# Altium project ControleArduino.PrjPcb
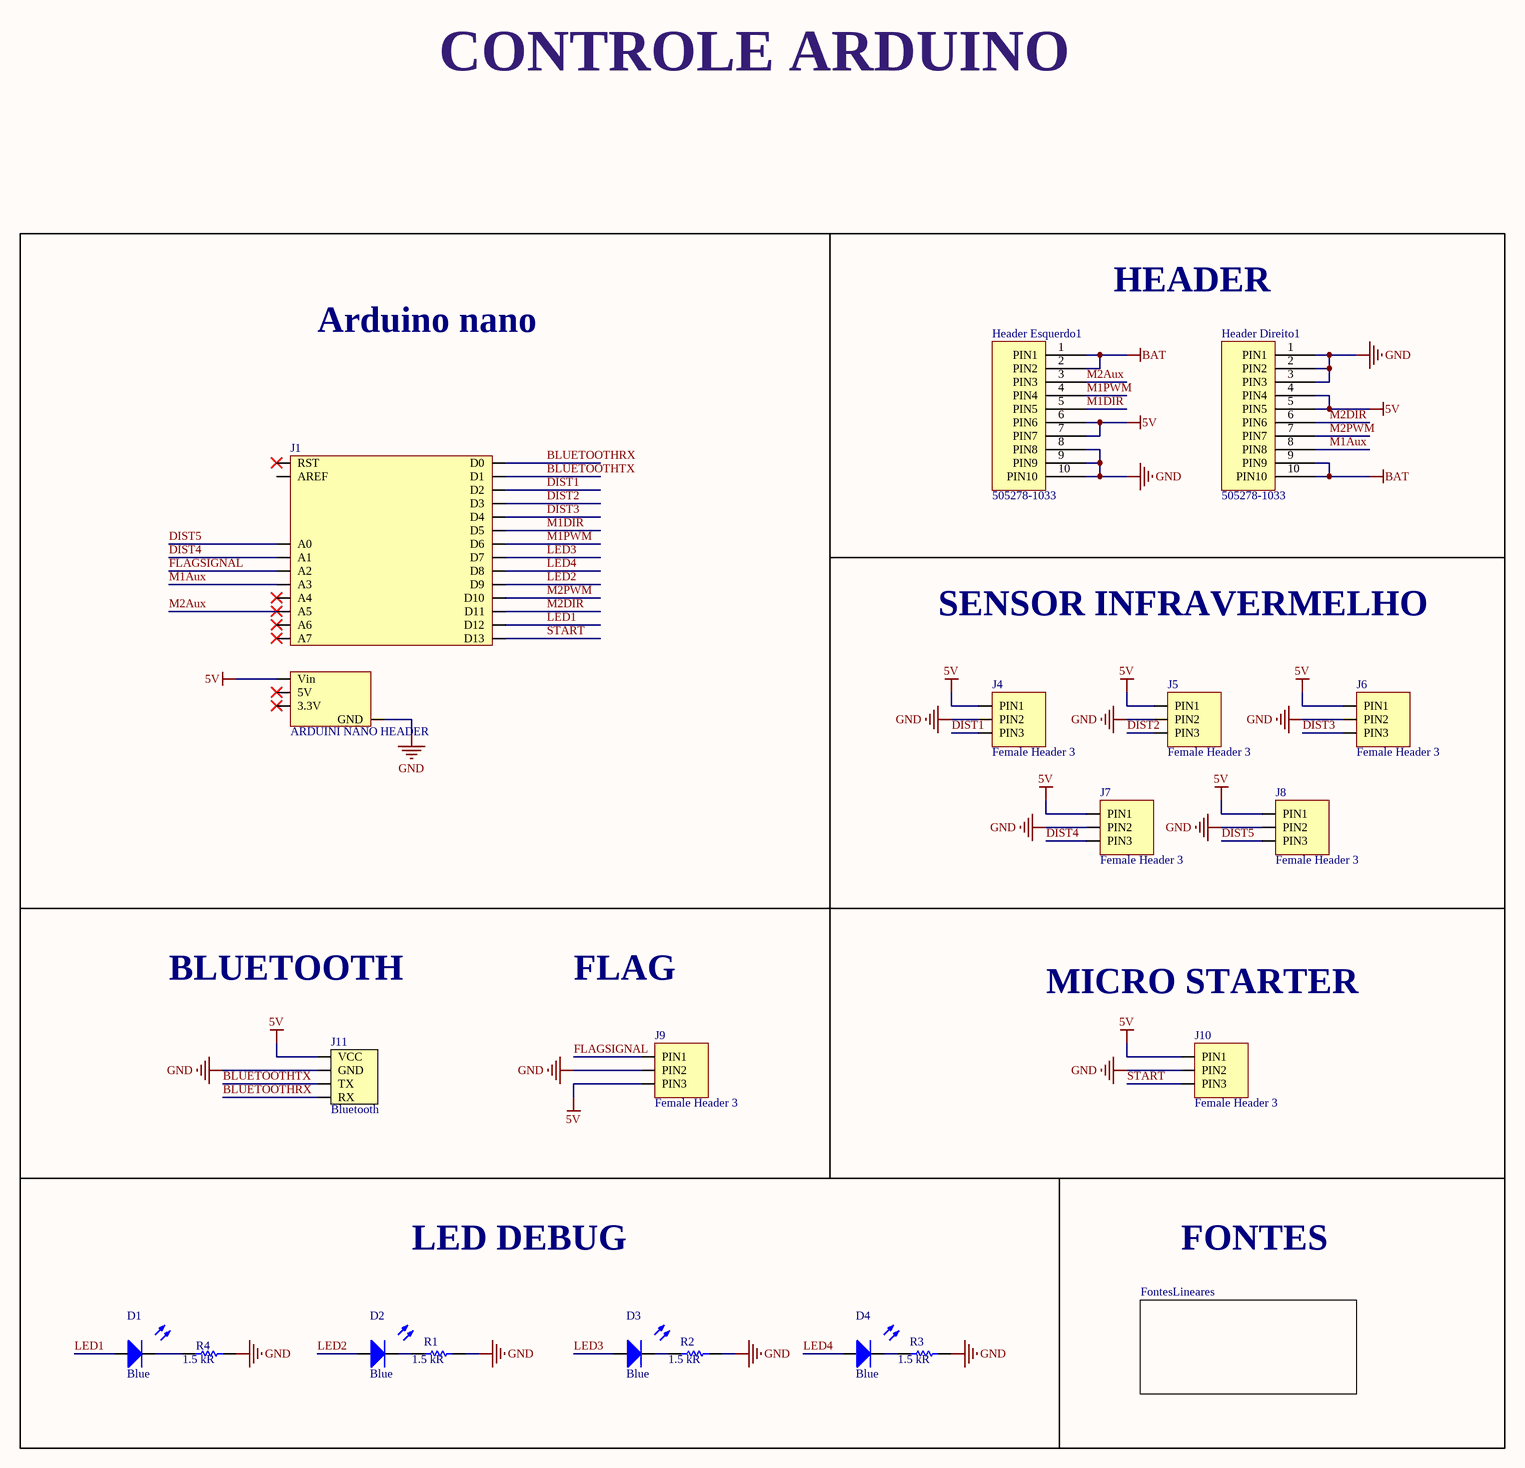
[diagram p0: controleArduino.SchDoc]
2 sheets, 28 parts. Net scope: global (net labels, ports and power ports of the same name join across sheets).
Board file: ControleArduinoPCB.PcbDoc
Sheets:
  controleArduino.SchDoc
    FontesLineares = FontesLineares.SchDoc

## Sheet controleArduino.SchDoc
size A2; SheetNumber: 1; SheetTotal: 2

### Parts
D1  Blue  [DIODO_2-SMD-3215]
D2  Blue  [DIODO_2-SMD-3215]
D3  Blue  [DIODO_2-SMD-3215]
D4  Blue  [DIODO_2-SMD-3215]
Header_Direito1  505278-1033  [FPC_CON]
Header_Esquerdo1  505278-1033  [FPC_CON]
J1  ARDUINI NANO HEADER  [ARDUINO NANO]
J4  Female Header 3  [FEMALE HEADER 3]
J5  Female Header 3  [FEMALE HEADER 3]
J6  Female Header 3  [FEMALE HEADER 3]
J7  Female Header 3  [FEMALE HEADER 3]
J8  Female Header 3  [FEMALE HEADER 3]
J9  Female Header 3  [FEMALE HEADER 3]
J10  Female Header 3  [FEMALE HEADER 3]
J11  Bluetooth  [BLUETOOTH]
R1  1.5 kR  [RESISTOR_0805]
R2  1.5 kR  [RESISTOR_0805]
R3  1.5 kR  [RESISTOR_0805]
R4  1.5 kR  [RESISTOR_0805]

### Sub-sheets
FontesLineares = FontesLineares: no entries

### Nets
5V: Header_Direito1.4(PIN4) Header_Direito1.5(PIN5) Header_Esquerdo1.6(PIN6) Header_Esquerdo1.7(PIN7) J1.Vin J4.PIN1 J5.PIN1 J6.PIN1 J7.PIN1 J8.PIN1 J9.PIN3 J10.PIN1 J11.VCC
BAT: Header_Direito1.9(PIN9) Header_Direito1.10(PIN10) Header_Esquerdo1.1(PIN1) Header_Esquerdo1.2(PIN2)
GND: Header_Direito1.1(PIN1) Header_Direito1.2(PIN2) Header_Direito1.3(PIN3) Header_Esquerdo1.8(PIN8) Header_Esquerdo1.9(PIN9) Header_Esquerdo1.10(PIN10) J1.GND J4.PIN2 J5.PIN2 J6.PIN2 J7.PIN2 J8.PIN2 J9.PIN2 J10.PIN2 J11.GND R1.2 R2.2 R3.2 R4.2
BLUETOOTHRX: J1.D0 J11.RX
BLUETOOTHTX: J1.D1 J11.TX
DIST1: J1.D2 J4.PIN3
DIST2: J1.D3 J5.PIN3
DIST3: J1.D4 J6.PIN3
DIST4: J1.A1 J7.PIN3
DIST5: J1.A0 J8.PIN3
FLAGSIGNAL: J1.A2 J9.PIN1
LED1: D1.A J1.D12
LED2: D2.A J1.D9
LED3: D3.A J1.D7
LED4: D4.A J1.D8
M1Aux: Header_Direito1.8(PIN8) J1.A3
M1DIR: Header_Esquerdo1.5(PIN5) J1.D5
M1PWM: Header_Esquerdo1.4(PIN4) J1.D6
M2Aux: Header_Esquerdo1.3(PIN3) J1.A5
M2DIR: Header_Direito1.6(PIN6) J1.D11
M2PWM: Header_Direito1.7(PIN7) J1.D10
START: J1.D13 J10.PIN3
NetD1_C: D1.C R4.1
NetD2_C: D2.C R1.1
NetD3_C: D3.C R2.1
NetD4_C: D4.C R3.1

Not connected (* = marked no-connect by the designer): J1 3.3V* 5V* A4* A6* A7* AREF RST*

### Notes on the sheet
- CONTROLE ARDUINO
- HEADER
- Arduino nano
- SENSOR INFRAVERMELHO
- BLUETOOTH
- FLAG
- MICRO STARTER
- LED DEBUG
- FONTES

### Library data of the parts
D1-D4 = EAST3215BA5: LED 75mW BLUE 45MCD 3215; Manufacturer: Everlight Electronics; Current - Forward (If): 20 mA; Voltage - Forward (Vf): 3,30 V; Viewing Angle: 130°; Wavelength: 468 nm; Reverse Voltage: 5 V; Library Control - Checked Footprint: yes; Library Control - Person that Checked Footprint: Lucas; Library Control - Person that did the Last Update Footprint: Stéfany (Ster); Supplier 1: Mouser; Part Number: EAST3215BA5; Category: Standard LEDs - SMD; Price: 1 = 0,3800, 10 = 0,2050, 100 = 0.1080 (USD); Package / Case: 3215; Color: Blue; Operating Temperature: - 40 °C ~ 85 °C; Luminous Intensity: 45 mcd; Library Ref: Diodo/Led; Supplier Part Number 1: 638-EAST3215BA5; Max Power Dissipation: 75 mW; Max Current Rating: 20 mA; Library Control - Checked Schematic: yes; Library Control - Last Update: 13/06/2021 12:45; Library Control - Person that Checked Schematic: Lucas; Library Control - Person that did the Last Update Schematic: Stéfany (Ster); ComponentLink1Description: Mouser Link; ComponentLink1URL: https://www.mouser.com/ProductDetail/Everlight/EAST3215BA5?qs=Cqqh%252BS766wnzp9nQVj5A4g==; ComponentLink2Description: Datasheet; ComponentLink2URL: https://www.mouser.com/datasheet/2/143/EAST3215BA5-1154292.pdf
Header_Direito1 Header_Esquerdo1 = 505278-1033_BODY: CONN FFC/FPC HORZ 10POS 0.50MM; Manufacturer: Molex; Current Rating (Amps): 500mA; Number of Positions: 10; Library Control - Checked Footprint: Yes; Library Control - Last Project that Used: Follow-Final; Library Control - Person that Checked Footprint: Lucas; Library Control - Person that did the Last Update Footprint: Mateus(Dimas); Supplier 1: Mouser; Part Number: 505278-1033; Category: Connectors; Price: 1=0,51000, 10=0,42900, 100=0,33400 (USD); Mounting Type: Right Angle; Contact Material: Tin; Operating Temperature: -40°C ~ 85°C; Library Ref: Connectors; Number of Rows: 1; Termination: SMD; Insulation Material: Liquid Crystal Polymer; Contact Type: FFC/FPC; Pitch: 0.50mm; Contact Length - Mating: 0.50mm; Supplier Part Number 1: 538-505278-1033; Library Control - Checked Schematic: Yes; Library Control - Last Update: 24/04/2021 00:25; Library Control - Person that Checked Schematic: Lucas; Library Control - Person that did the Last Update Schematic: Mateus(Dimas); ComponentLink1Description: Datasheet; ComponentLink1URL: https://br.mouser.com/datasheet/2/276/2/5052781033_FFC_FPC_CONNECTORS-772019.pdf; ComponentLink2Description: Mouser Link; ComponentLink2URL: https://br.mouser.com/ProductDetail/Molex/505278-1033?qs=c8NFF48pVsDStgrQCBOSTg%3D%3D
J1 = Header Arduino Nano
J4-J10 = Female Header 3: Number of Contacts: 3; System: Connector; Library Ref: Header
J11 = Barramento Bluetooth: BARRAMENTO BLUETOOTH HC-06; Number of Contacts: 4; Bluetooth Mode: Slave Only; Operating Voltage: 3,6 / 6 (V); Max Range: 10m; Frequency: 2,4 GHz; Modulation: GFSK (Gaussian Frequency Shift Keying); Recomended Operating Configuration: 5V @ 50mA; Maximum Serial Transmission Rate: 9600 bps; Library Ref: Header
R1-R4 = CRCW08051K50FKEAC: RES SMD 1.5K OHM 1% 1/8W 0805; Manufacturer: Vishay / Dale; Temperature Coefficient: 100 PPM / C; Power Rating: 125 mW (1/8 W); Voltage Rating: 150 V; Library Control - Checked Footprint: Yes; Library Control - Person that Checked Footprint: Nikaum; Library Control - Person that did the Last Update Footprint: Nicolas; Supplier 1: Mouser; Part Number: CRCW08051K50FKEAC; Category: Thick Film Resistors - SMD; Price: 1=0,10, 10=0,059, 100=0,024 (USD); Package / Case: 0805 (2012 Metric); Operating Temperature: -55 C ~ 155 C; Value: 1.5 kR; Tolerance: 1 %; Library Ref: Resistor; Resistor Type: Fixo; Size / Dimension: 2,00 L x 1,25 W x 0,45 H; Supplier Part Number 1: 71-CRCW08051K50FKEAC; Library Control - Checked Schematic: Yes; Library Control - Last Update: 27/06/2021 20:45; Library Control - Person that Checked Schematic: Nikaum; Library Control - Person that did the Last Update Schematic: Nikaum; ComponentLink1Description: Mouser Link; ComponentLink1URL: https://br.mouser.com/ProductDetail/Vishay-Dale/CRCW08051K50FKEAC?qs=E3Y5ESvWgWMwo6R2oqPQ9Q%3D%3D; ComponentLink2Description: Datasheet; ComponentLink2URL: https://br.mouser.com/datasheet/2/427/crcwce3-1762584.pdf

## Sheet FontesLineares.SchDoc
size A4; SheetNumber: 2; SheetTotal: 2
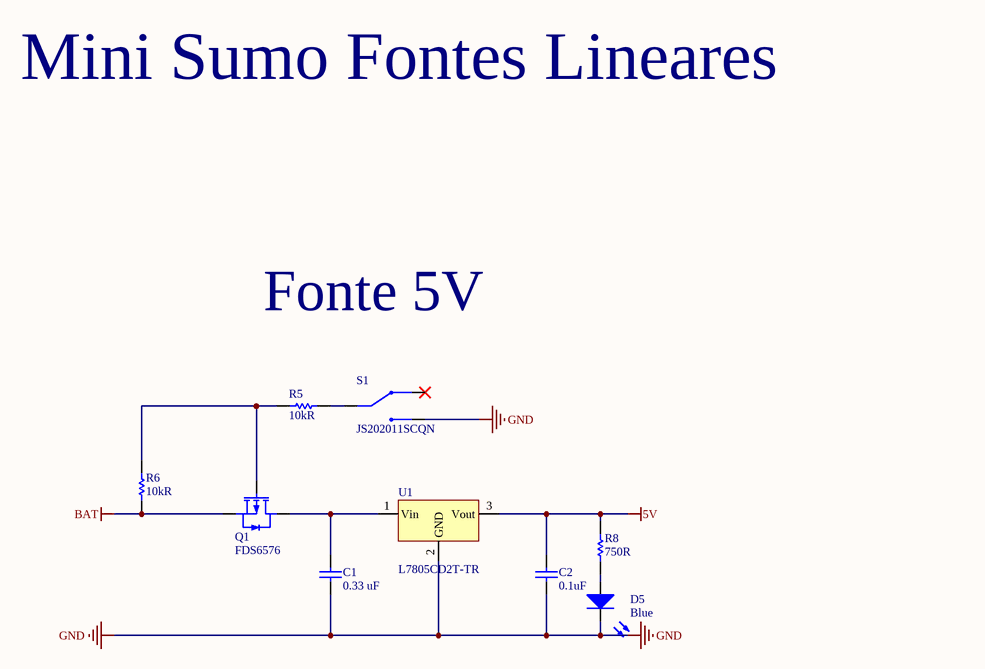
[diagram p1: FontesLineares.SchDoc]

### Parts
C1  0.33 uF  [C0805]
C2  0.1uF  [C0805]
D5  Blue  [DIODO_2-SMD-3215]
Q1  FDS6576  [SOIC-8]
R5  10kR  [RESISTOR_0603]
R6  10kR  [RESISTOR_0603]
R8  750R  [RESISTOR_0805]
S1  JS202011SCQN  [DPDT]
U1  L7805CD2T-TR  [D2PAK]

### Nets
5V: C2.2 R8.2 U1.3(Vout)
BAT: Q1.S R6.1
GND: C1.1 C2.1 D5.C S1.A3 U1.2(GND)
NetC1_2: C1.2 Q1.D U1.1(Vin)
NetD5_A: D5.A R8.1
NetQ1_G: Q1.G R5.2 R6.2
NetR5_1: R5.1 S1.A1

Not connected (* = marked no-connect by the designer): S1 A2(4)*

### Notes on the sheet
- Mini Sumo Fontes Lineares
- Fonte 5V

### Library data of the parts
C1 = GCM21BR71E334KA37K: CAP CER 0.33UF 25V X7R 0805; Manufacturer: Murata Eletronics; Tolerance: 10%; Voltage - Rated: 25 VDC; Library Control - Checked Footprint: Yes; Library Control - Person that Checked Footprint: Nikaum; Supplier 1: Mouser; Part Number: GCM21BR71E334KA37K; Category: Ceramic Capacitor; Price: 1= 0,57, 10= 0,398, 100= 0,239 (USD); Supplier Part Number 1: 81-GCM21BR71E334KA7K; Library Ref: Capacitor; Operating Temperature: -55 C ~ 125 C; Package / Case: 0805 (2012 Metric); Size / Dimension: 2,00 L x 1,25 W x 1,25 H; Value: 0.33 uF; Dieletric: X7R; Library Control - Checked Schematic: Yes; Library Control - Last Update: 28/06/2021 00:57; Library Control - Person that Checked Schematic: Nikaum; Library Control - Person that did the Last Update Footprint: Nikaum; Library Control - Person that did the Last Update Schematic: Nikaum; ComponentLink1Description: Datasheet; ComponentLink1URL: https://br.mouser.com/datasheet/2/281/GCM21BR71E334KA37_01-1968656.pdf; ComponentLink2Description: Mouser Link; ComponentLink2URL: https://br.mouser.com/ProductDetail/Murata-Electronics/GCM21BR71E334KA37K?qs=N3Kl9KD794Tg%2FXM5q2uFQQ%3D%3D; ComponentLink3Description: ESR; ComponentLink3URL: https://www.murata.com/en-us/products/productdetail?partno=GCM21BR71E334KA37%23
C2 = C0805C104M3RACTU: CAP CER 0.1uF 25V X7R 0805; Manufacturer: Kemet; Tolerance: 20%; Voltage - Rated: 25 VDC; Library Control - Checked Footprint: No; Library Control - Checked Schematic: Yes; Library Control - Person that Checked Schematic: Guilherme; Library Control - Person that did the Last Update Schematic: Marcos; Supplier 1: Mouser; Part Number: C0805C104M3RACTU; Category: Ceramic Capacitor; Price: 1=0,13 10=0,064 100=0,037 1000=0,025 (USD); Supplier Part Number 1: 80-C0805C104M3R; Library Ref: Capacitor; Operating Temperature: -55 C ~ 125 C; Package / Case: 0805(2012 mestric); Size / Dimension: 1.25 mm W x 2 mm L x 0.78 mm H; Value: 0.1uF; ESR: -; Dieletric: X7R; Library Control - Last Update: 26/06/2021 20:52; ComponentLink1Description: Datasheet; ComponentLink1URL: https://br.mouser.com/datasheet/2/212/KEM_C1002_X7R_SMD-1102033.pdf; ComponentLink2Description: Mouser Link; ComponentLink2URL: https://br.mouser.com/ProductDetail/KEMET/C0805C104M3RACTU?qs=jbCUrP3sAgSIdMuvv9W4Pg%3D%3D
D5 = EAST3215BA5: as D1 on sheet controleArduino; Supplier 1: Mouser; Part Number: EAST3215BA5; Category: Standard LEDs - SMD; Price: 1 = 0,3800, 10 = 0,2050, 100 = 0.1080 (USD); Package / Case: 3215; Color: Blue; Operating Temperature: - 40 °C ~ 85 °C; Luminous Intensity: 45 mcd; Library Ref: Diodo/Led; Supplier Part Number 1: 638-EAST3215BA5; Max Power Dissipation: 75 mW; Max Current Rating: 20 mA; Library Control - Checked Schematic: yes; Library Control - Last Update: 13/06/2021 12:45; Library Control - Person that Checked Schematic: Lucas; Library Control - Person that did the Last Update Schematic: Stéfany (Ster); ComponentLink1Description: Mouser Link; ComponentLink1URL: https://www.mouser.com/ProductDetail/Everlight/EAST3215BA5?qs=Cqqh%252BS766wnzp9nQVj5A4g==; ComponentLink2Description: Datasheet; ComponentLink2URL: https://www.mouser.com/datasheet/2/143/EAST3215BA5-1154292.pdf
Q1 = FDS6576: MOSFET P-CH 20V 11A SOIC-8; Manufacturer: onsemi / Fairchild; FET Type: P-Channel; Rds On (Max) @ Id, Vgs: 23mOhms @ -11A, -4.5V; Input Capacitance (Ciss) (Max) @Vds: 4044pF@-10V; Drain to Source Voltage (Vds): -20V; Vgs(th) (Max) Id: -1.5V@-250uA; Current - Continuous Drain (Id) @25°C: -11A; Gate Charge (Qg) (Max) @ Vgs: 60nC@-4.5V; Power Dissipation (Max): 2.5W; Drive Voltage (Max Rds On, Min Rds On): -2.5V ~4.5V; Vgs (Max): 12V; Rise / Fall Time (Typ): 17 / 79 (ns); Part Number: SOIC-8; Price: 1=1.34, 10=1.20, 100=0.932, 500=0.77, 1000=0.608 (USD); Package / Case: SOIC-8; Operating Temperature: -55 °C ~150 °C; Supplier 1: Mouser; Library Ref: Mosfet; Supplier Part Number 1: 512-FDS6576; ComponentLink1Description: Datasheet; ComponentLink1URL: https://br.mouser.com/datasheet/2/308/1/FDS6576_D-1808687.pdf; ComponentLink2Description: Mouser; ComponentLink2URL: https://br.mouser.com/ProductDetail/onsemi-Fairchild/FDS6576?qs=FOlmdCx%252BAA1N14vq5QZP7Q%3D%3D
R5 R6 = RC0603JR-0710KL: RES SMD 10K OHM 5% 1/10W 0603; Manufacturer: Yageo; Temperature Coefficient: 100 PPM / C; Power Rating: 100 mW (1/10 W); Voltage Rating: 75 V; Library Control - Checked Footprint: No; Library Control - Checked Schematic: Yes; Library Control - Person that Checked Schematic: Marcos; Library Control - Person that did the Last Update Footprint: Dalarme; Supplier 1: Mouser; Part Number: RC0603JR-0710KL; Category: Thick Film Resistors - SMD; Price: 1=0,10, 10=0,015, 100=0,005 1000=0,0040 (USD); Package / Case: 0603 (1608 Metric); Operating Temperature: - 55ºC ~ 155ºC; Value: 10kR; Tolerance: 5 %; Library Ref: Resistor; Resistor Type: Fixo; Size / Dimension: 1.6 mm L x  0.8 mm W x  0.45 mm H; Supplier Part Number 1: 603-RC0603JR-0710KL; Library Control - Last Update: 21/06/21 14:15; Library Control - Person that did the Last Update Schematic: Marcos; ComponentLink1Description: Mouser Link; ComponentLink1URL: https://br.mouser.com/ProductDetail/Yageo/RC0603JR-0710KL?qs=ksOUTF%2FWcd8D6T22BJkQ7g%3D%3D; ComponentLink2Description: Datsheet Link; ComponentLink2URL: https://br.mouser.com/datasheet/2/447/Yageo_03_18_2021_PYu_RC_Group_51_RoHS_L_11-2199992.pdf
R8 = ERJ-6GEYJ751V: RES SMD 750 OHM 5% 1/8W 0805; Manufacturer: Panasonic; Temperature Coefficient: 200 PPM / C; Power Rating: 125 mW (1/8 W); Voltage Rating: 150 V; Library Control - Checked Footprint: Yes; Library Control - Person that Checked Footprint: Nikaum; Library Control - Person that Checked Schematic: Guilherme; Library Control - Person that did the Last Update Footprint: Dalarme; Supplier 1: Mouser; Part Number: ERJ-6GEYJ751V; Category: Thick Film Resistors - SMD; Price: 1=0,10, 10=0,055, 100=0,021 (USD); Package / Case: 0805 (2012 Metric); Operating Temperature: - 55ºC ~ 155ºC; Value: 750R; Tolerance: 5 %; Library Ref: Resistor; Resistor Type: Fixed; Size / Dimension: 2 mm L x  1.25 mm W x  0.6 mm H; Supplier Part Number 1: 667-ERJ-6GEYJ751V; Library Control - Checked Schematic: Yes; Library Control - Last Update: 27/06/2021 20:29; Library Control - Person that did the Last Update Schematic: Nikaum; ComponentLink1Description: Mouser Link; ComponentLink1URL: https://br.mouser.com/ProductDetail/Panasonic/ERJ-6GEYJ751V?qs=sGAEpiMZZMukHu%252BjC5l7YYjpZ9X9PhOCxoCk8Svj5Vk%3D; ComponentLink2Description: Datasheet; ComponentLink2URL: https://br.mouser.com/datasheet/2/315/AOA0000C301-1488782.pdf
S1 = JS202011SCQN: DEEP SWITCH 4 POSITIONS; Manufacturer: C&K; Current Rating: 300 mA; Voltage Rating DC: 30 VDC; Switch Function: ON - ON; Library Control - Checked Footprint: Yes; Library Control - Person that Checked Footprint: Nikaum; Part Number: JS202011SCQN; Operating Temperature(max - min): -20~70°C; Supplier: Mouser; ComponentLink1Description: Mouser Link; ComponentLink1URL: https://br.mouser.com/ProductDetail/CK/JS202011SCQN?qs=LgMIjt8LuD95JYWxZ7NvZA%3D%3D; ComponentLink2Description: Datasheet Link; ComponentLink2URL: https://www.mouser.com/datasheet/2/60/js-1841892.pdf; Mouser Part Number: 611-JS202011SCQN; Library Ref: Diversos; Library Control - Last Update: 15/06/2021; Library Control - Person that Checked Schematic: Nikaum; Library Control - Person that did the Last Update Footprint: Nikaum; Library Control - Person that did the Last Update Schematic: Nikaum; Library Control - Checked Schematic: Yes
U1 = L7805CD2T-TR: IC REG LINEAR 5V 1A D2PAK; Manufacturer: ST; Max Power Dissipation: Internally Limited; Output Type: Fixed; Number of Regulators: 1; Voltage - Input (Max): 35V; Current - Quiescent (Iq): 8mA; Voltage - Dropout (Max): 2V; Library Control - Checked Footprint: Yes; Library Control - Person that Checked Footprint: Nícolas; Voltage - Output (Max): 5.25V; Supplier 1: Mouser; Part Number: L7805CD2T-TR; Library Ref: Voltage Regulator; Category: Linear Voltage Regulator; Price: 1=0,93, 10=0,83, 100=0,79 (USD); Package/ Case: D2PAK; Operating Temperature: -40~125 ºC; Voltage - Output (Min/Fixed): 5V; Supplier Part Number 1: 511-L7805CD2T-TR; Library Control - Checked Schematic: Yes; Library Control - Last Update: 25/06/21; Library Control - Person that Checked Schematic: Nícolas; Library Control - Person that did the Last Update Schematic: Nícolas; Current - Output: 1A; Power Dissipation: Internally Limited; ComponentLink1Description: Mouser Link; ComponentLink1URL: https://br.mouser.com/ProductDetail/STMicroelectronics/L7805CD2T-TR?qs=%2Fha2pyFadujE9KQ1BxQHaLKqcK8XYkwQA8UfL%2FIGb8dfQq%2Fq%2FT%2Fjqg%3D%3D; ComponentLink2Description: Datasheet; ComponentLink2URL: https://br.mouser.com/datasheet/2/389/cd00000444-1795274.pdf

## Nets that join several sheets
5V: controleArduino (13 pins), FontesLineares (C2.2 R8.2 U1.3)
BAT: controleArduino (Header_Direito1.9 Header_Direito1.10 Header_Esquerdo1.1 Header_Esquerdo1.2), FontesLineares (Q1.S R6.1)
GND: controleArduino (19 pins), FontesLineares (5 pins)